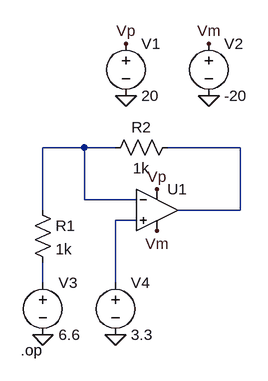
[diagram p0: schematic Draft1.asc]
Draft1.asc, the LTspice schematic file:
Version 4
SHEET 1 880 680
WIRE 96 0 32 0
WIRE 144 0 96 0
WIRE 336 0 224 0
WIRE 96 80 96 0
WIRE 176 80 96 80
WIRE 32 96 32 0
WIRE 336 96 336 0
WIRE 336 96 240 96
WIRE 176 112 144 112
WIRE 32 208 32 176
WIRE 144 208 144 112
FLAG 160 -80 0
FLAG 288 -80 0
FLAG 32 288 0
FLAG 160 -160 Vp
FLAG 208 64 Vp
FLAG 288 -160 Vm
FLAG 208 128 Vm
FLAG 144 288 0
DATAFLAG 336 48 ""
SYMBOL OpAmps\\UniversalOpAmp2 208 96 R0
SYMATTR InstName U1
SYMBOL voltage 160 -176 R0
WINDOW 123 0 0 Left 0
WINDOW 39 0 0 Left 0
SYMATTR InstName V1
SYMATTR Value 20
SYMBOL voltage 288 -176 R0
WINDOW 123 0 0 Left 0
WINDOW 39 0 0 Left 0
SYMATTR InstName V2
SYMATTR Value -20
SYMBOL voltage 32 192 R0
WINDOW 123 0 0 Left 0
WINDOW 39 0 0 Left 0
SYMATTR InstName V3
SYMATTR Value 6.6
SYMBOL res 16 80 R0
SYMATTR InstName R1
SYMATTR Value 1k
SYMBOL res 240 -16 R90
WINDOW 0 0 56 VBottom 2
WINDOW 3 32 56 VTop 2
SYMATTR InstName R2
SYMATTR Value 1k
SYMBOL voltage 144 192 R0
WINDOW 123 0 0 Left 0
WINDOW 39 0 0 Left 0
SYMATTR InstName V4
SYMATTR Value 3.3
TEXT -2 312 Left 2 !.op

The netlist it stands for:
* Draft1.asc
XU1 N003 N001 Vp Vm N002 level2 Avol=1Meg GBW=10Meg Slew=10Meg Ilimit=25m Rail=0 Vos=0 En=0 Enk=0 In=0 Ink=0 Rin=500Meg  ; pins In+ In- V+ V- OUT
V1 Vp 0 20
V2 Vm 0 -20
V3 N004 0 6.6
R1 N001 N004 1k
R2 N002 N001 1k
V4 N003 0 3.3
.op
.lib UniversalOpAmp2.lib
.backanno
.end